# EAGLE design Mini-Voyger2_V13 (EAGLE 7.3.0)
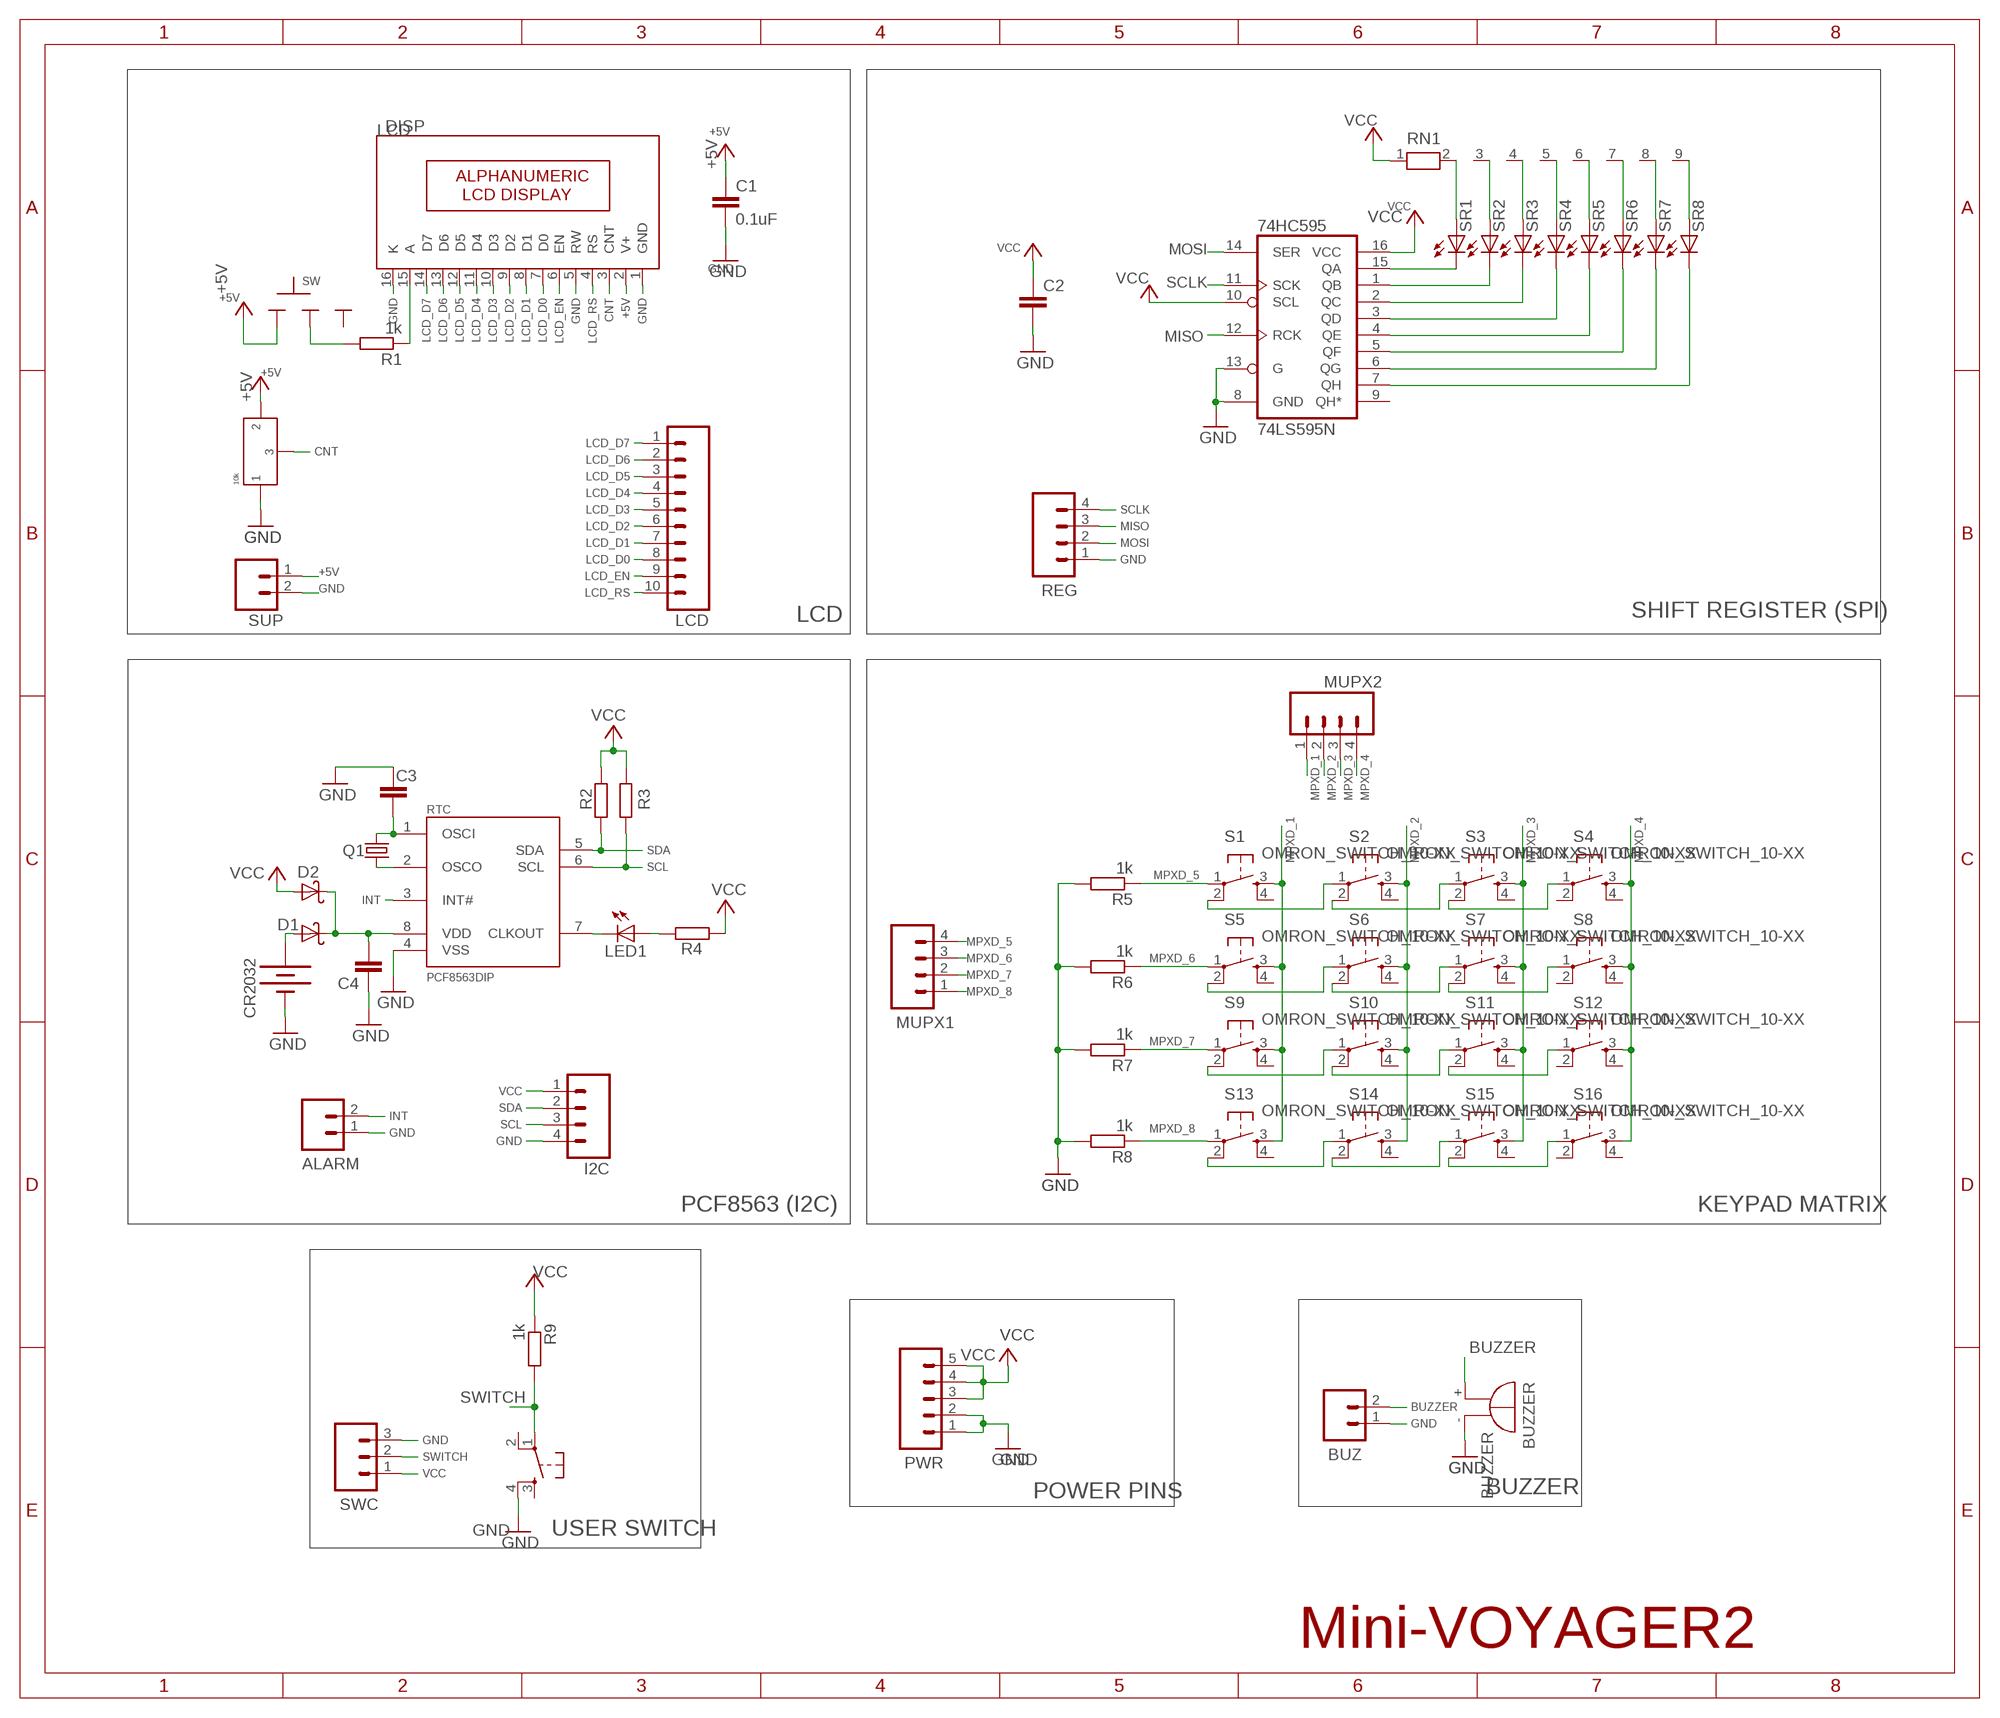
[diagram p0: schematic, sheet 1]

## Parts
74HC595  74LS595N  [DIL16]
ALARM  M02  [02P]
BUZ  M02  [02P]
BUZZER  BUZZER  [F/TMB]
C1  0.1uF  C-EU025-024X044  [C025-024X044]
C2  0.1uF  C-EU025-025X050  [C025-025X050]
C3  22pF  C-EU025-024X044  [C025-024X044]
C4  0.1uF  C-EU050-025X075  [C050-025X075]
CR2032  BATTERY20PTH  [BATTCOM_20MM_PTH]
D1  1N5819  [DO41-10]
D2  1N5819  [DO41-10]
DISP  LCD  16X2LCD  [16X2_LCD]
I2C  M04  [04P]
LCD  M10  [10P]
LED1  LED3MM  [LED3MM]
MUPX1  M04  [04P]
MUPX2  M04  [04P]
PRESET  10k  PRESET_LR  [PRESET_LR]
PWR  M05  [05P]
Q1  32678Hz  CRYSTALTC26H  [TC26H]
R1  1k  R-EU_0207/7  [0207/7]
R2  10k  R-EU_0207/7  [0207/7]
R3  10k  R-EU_0207/7  [0207/7]
R4  470  R-EU_0207/7  [0207/7]
R5  1k  R-EU_0207/7  [0207/7]
R6  1k  R-EU_0207/7  [0207/7]
R7  1k  R-EU_0207/7  [0207/7]
R8  1k  R-EU_0207/7  [0207/7]
R9  1k  R-EU_0207/7  [0207/7]
REG  M04  [04P]
RN1  1k  RN08  [RN-9]
RTC  PCF8563DIP  [DIL08]
S1  OMRON_SWITCH_10-XX  [B3F-10XX]
S2  OMRON_SWITCH_10-XX  [B3F-10XX]
S3  OMRON_SWITCH_10-XX  [B3F-10XX]
S4  OMRON_SWITCH_10-XX  [B3F-10XX]
S5  OMRON_SWITCH_10-XX  [B3F-10XX]
S6  OMRON_SWITCH_10-XX  [B3F-10XX]
S7  OMRON_SWITCH_10-XX  [B3F-10XX]
S8  OMRON_SWITCH_10-XX  [B3F-10XX]
S9  OMRON_SWITCH_10-XX  [B3F-10XX]
S10  OMRON_SWITCH_10-XX  [B3F-10XX]
S11  OMRON_SWITCH_10-XX  [B3F-10XX]
S12  OMRON_SWITCH_10-XX  [B3F-10XX]
S13  OMRON_SWITCH_10-XX  [B3F-10XX]
S14  OMRON_SWITCH_10-XX  [B3F-10XX]
S15  OMRON_SWITCH_10-XX  [B3F-10XX]
S16  OMRON_SWITCH_10-XX  [B3F-10XX]
SR1  LED3MM  [LED3MM]
SR2  LED3MM  [LED3MM]
SR3  LED3MM  [LED3MM]
SR4  LED3MM  [LED3MM]
SR5  LED3MM  [LED3MM]
SR6  LED3MM  [LED3MM]
SR7  LED3MM  [LED3MM]
SR8  LED3MM  [LED3MM]
SUP  M02  [02P]
SW  SLIDESWITCH-BIG  [BIGSWITCH]
SW1  OMRON_SWITCH_10-XX  [B3F-10XX]
SWC  M03  [03P]

## Nets
+5V: C1.1 DISP.2(V+) PRESET.P$2 SUP.1 SW.1
BUZZER: BUZ.2 BUZZER.+
CNT: DISP.3(CNT) PRESET.P$3
GND: 74HC595.8(GND) 74HC595.13(G) ALARM.1 BUZ.1 BUZZER.- C1.2 C2.2 C3.2 C4.1 CR2032.2(-) DISP.1(GND) DISP.5(RW) DISP.16(K) I2C.4 PRESET.P$1 PWR.1 PWR.2 R5.2 R6.2 R7.2 R8.2 REG.1 RTC.4(VSS) SUP.2 SW1.4(S1) SWC.3
INT: ALARM.2 RTC.3(INT#)
LCD_D0: DISP.7(D0) LCD.8
LCD_D1: DISP.8(D1) LCD.7
LCD_D2: DISP.9(D2) LCD.6
LCD_D3: DISP.10(D3) LCD.5
LCD_D4: DISP.11(D4) LCD.4
LCD_D5: DISP.12(D5) LCD.3
LCD_D6: DISP.13(D6) LCD.2
LCD_D7: DISP.14(D7) LCD.1
LCD_EN: DISP.6(EN) LCD.9
LCD_RS: DISP.4(RS) LCD.10
MISO: 74HC595.12(RCK) REG.3
MOSI: 74HC595.14(SER) REG.2
MPXD_1: MUPX2.1 S1.3(S) S5.3(S) S9.3(S) S13.3(S)
MPXD_2: MUPX2.2 S2.3(S) S6.3(S) S10.3(S) S14.3(S)
MPXD_3: MUPX2.3 S3.3(S) S7.3(S) S11.3(S) S15.3(S)
MPXD_4: MUPX2.4 S4.3(S) S8.3(S) S12.3(S) S16.3(S)
MPXD_5: MUPX1.4 R5.1 S1.1(P)
MPXD_6: MUPX1.3 R6.1 S5.1(P)
MPXD_7: MUPX1.2 R7.1 S9.1(P)
MPXD_8: MUPX1.1 R8.1 S13.1(P)
N$1 [power]: C4.2 D1.C D2.C RTC.8(VDD)
N$2: R1.2 SW.2
N$3: 74HC595.15(QA) SR1.K(C)
N$4: 74HC595.2(QC) SR3.K(C)
N$8: S1.2(P1) S2.1(P)
N$10: S2.2(P1) S3.1(P)
N$11: S3.2(P1) S4.1(P)
N$12: S5.2(P1) S6.1(P)
N$13: S6.2(P1) S7.1(P)
N$14: S7.2(P1) S8.1(P)
N$15: S9.2(P1) S10.1(P)
N$16: S10.2(P1) S11.1(P)
N$17: S11.2(P1) S12.1(P)
N$18: S13.2(P1) S14.1(P)
N$19: S14.2(P1) S15.1(P)
N$20: S15.2(P1) S16.1(P)
N$22: 74HC595.3(QD) SR4.K(C)
N$24: DISP.15(A) R1.1
N$29: 74HC595.4(QE) SR5.K(C)
N$39: 74HC595.5(QF) SR6.K(C)
N$40: 74HC595.6(QG) SR7.K(C)
N$41: 74HC595.7(QH) SR8.K(C)
N$42: 74HC595.1(QB) SR2.K(C)
N$43: RN1.2 SR1.A
N$44: RN1.3 SR2.A
N$45: RN1.4 SR3.A
N$46: RN1.5 SR4.A
N$47: RN1.6 SR5.A
N$48: RN1.7 SR6.A
N$49: RN1.8 SR7.A
N$50: RN1.9 SR8.A
N$56 [power]: CR2032.1(+) D1.A
N$57: Q1.1 RTC.2(OSCO)
N$58: C3.1 Q1.2 RTC.1(OSCI)
N$59: LED1.A R4.1
N$60: LED1.K(C) RTC.7(CLKOUT)
SCL: I2C.3 R3.2 RTC.6(SCL)
SCLK: 74HC595.11(SCK) REG.4
SDA: I2C.2 R2.2 RTC.5(SDA)
SWITCH: R9.2 SW1.1(P) SWC.2
VCC: 74HC595.10(SCL) 74HC595.16(VCC) C2.1 D2.A I2C.1 PWR.3 PWR.4 PWR.5 R2.1 R3.1 R4.2 R9.1 RN1.1 SWC.1 ; supply symbol labelled +5V, +3V3
Unconnected: 74HC595.9(QH*) S1.4(S1) S2.4(S1) S3.4(S1) S4.2(P1) S4.4(S1) S5.4(S1) S6.4(S1) S7.4(S1) S8.2(P1) S8.4(S1) S9.4(S1) S10.4(S1) S11.4(S1) S12.2(P1) S12.4(S1) S13.4(S1) S14.4(S1) S15.4(S1) S16.2(P1) S16.4(S1) SW1.2(P1) SW1.3(S) SW.3

## Notes on the sheet
- LCD | SHIFT REGISTER (SPI)
- PCF8563 (I2C)
- KEYPAD MATRIX
- POWER PINS | BUZZER
- USER SWITCH
- Mini-VOYAGER2

## Library data of the parts
74HC595 = SparkFun-DigitalIC:74*595: 8-bit SHIFT REGISTER, output latch
ALARM = con-amp-quick:M02: AMP QUICK CONNECTOR; OC_FARNELL: unknown; OC_NEWARK: unknown
BUZ SUP = CEDT_SEPTEMBER_V2:M02: AMP QUICK CONNECTOR
BUZZER = CEDT_JANUARY_2015_v5:BUZZER: BUZZER Source: Buerklin; OC_FARNELL: unknown; OC_NEWARK: unknown
C1-C4 = rcl:C-EU: CAPACITOR, European symbol
CR2032 = SparkFun-Electromechanical:BATTERY: Battery Holders Various common sizes : AA, AAA, 20mm coin cell and 12mm coin cell. 20MM_4LEGS, BATT-10373
D1 D2 = CEDT_JANUARY_2015:1N5819: DIODE general purpose rectifier, 1 A
DISP = CEDT_JANUARY_2015_v4:16X2LCD: ALPHANUMERIC-LCD
I2C = con-amp-quick:M04: AMP QUICK CONNECTOR; OC_FARNELL: unknown; OC_NEWARK: unknown
LCD = con-amp-quick:M10: AMP QUICK CONNECTOR; OC_FARNELL: unknown; OC_NEWARK: unknown
LED1 = CEDT_JANUARY_2015_v2:LED
MUPX1 MUPX2 REG = Bottom_Board:M04: AMP QUICK CONNECTOR; OC_FARNELL: unknown; OC_NEWARK: unknown
PRESET = CEDT_JANUARY_2015_v5:PRESET_LR
PWR = con-amp-quick:M05: AMP QUICK CONNECTOR; OC_FARNELL: unknown; OC_NEWARK: unknown
Q1 = CEDT_JANUARY_2015:CRYSTAL: Crystals Various standard crystals. Proven footprints. Spark Fun Electronics SKU : COM-00534
R1-R9 = rcl:R-EU_: RESISTOR, European symbol
RN1 = resistor-net:RN08: RESISTOR NETWORK; OC_FARNELL: unknown; OC_NEWARK: unknown
RTC = CEDT_JANUARY_2015:PCF8563
S1-S16 = CEDT_JANUARY_2015_v7:OMRON_SWITCH
SR1-SR8 = 01_adafruit:LED: LED OSRAM: - CHIPLED LG R971, LG N971, LY N971, LG Q971, LY Q971, LO R971, LY R971 LH N974, LH R974 LS Q976, LO Q976, LY Q976 LO Q996 - Hyper CHIPLED LW Q18S LB Q993, LB Q99A, LB R99A - SideLED LS A670, LO A670, LY A670, LG A670, LP A670 LB A673, LV A673, LT A673, LW A673 LH A674 LY A675 LS A676, LA A676, LO A676, LY A676, LW A676 LS A679, LY A679, LG A679 - Hyper Micro SIDELED® LS Y876, LA Y876, LO Y876, LY Y876 LT Y87S - SmartLED LW L88C, LW L88S LB L89C, LB L89S, LG L890 LS L89K, LO L89K, LY L89K LS L896, LA L896, LO L896, LY L896 - TOPLED LS T670, LO T670, LY T670, LG T670, LP T670 LSG T670, LSP T670, LSY T670, LOP T670, LYG T670 LG T671, LOG T671, LSG T671 LB T673, LV T673, LT T673, LW T673 LH T674 LS T676, LA T676, LO T676, LY T676, LB T676, LH T676, LSB T676, LW T676 LB T67C, LV T67C, LT T67C, LS T67K, LO T67K, LY T67K, LW E67C LS E67B, LA E67B, LO E67B, LY E67B, LB E67C, LV E67C, LT E67C LW T67C LS T679, LY T679, LG T679 LS T770, LO T770, LY T770, LG T770, LP T770 LB T773, LV T773, LT T773, LW T773 LH T774 LS E675, LA E675, LY E675, LS T675 LS T776, LA T776, LO T776, LY T776, LB T776 LHGB T686 LT T68C, LB T68C - Hyper Mini TOPLED® LB M676 - Mini TOPLED Santana® LG M470 LS M47K, LO M47K, LY M47K Source: http://www.osram.convergy.de/
SW = CEDT_JANUARY_2015_v5:SLIDESWITCH
SW1 = CEDT_JANUARY_2015_v5:OMRON_SWITCH
SWC = con-amp-quick:M03: AMP QUICK CONNECTOR; OC_FARNELL: unknown; OC_NEWARK: unknown

## Net classes
1 power: width 0.813 mm

## Board
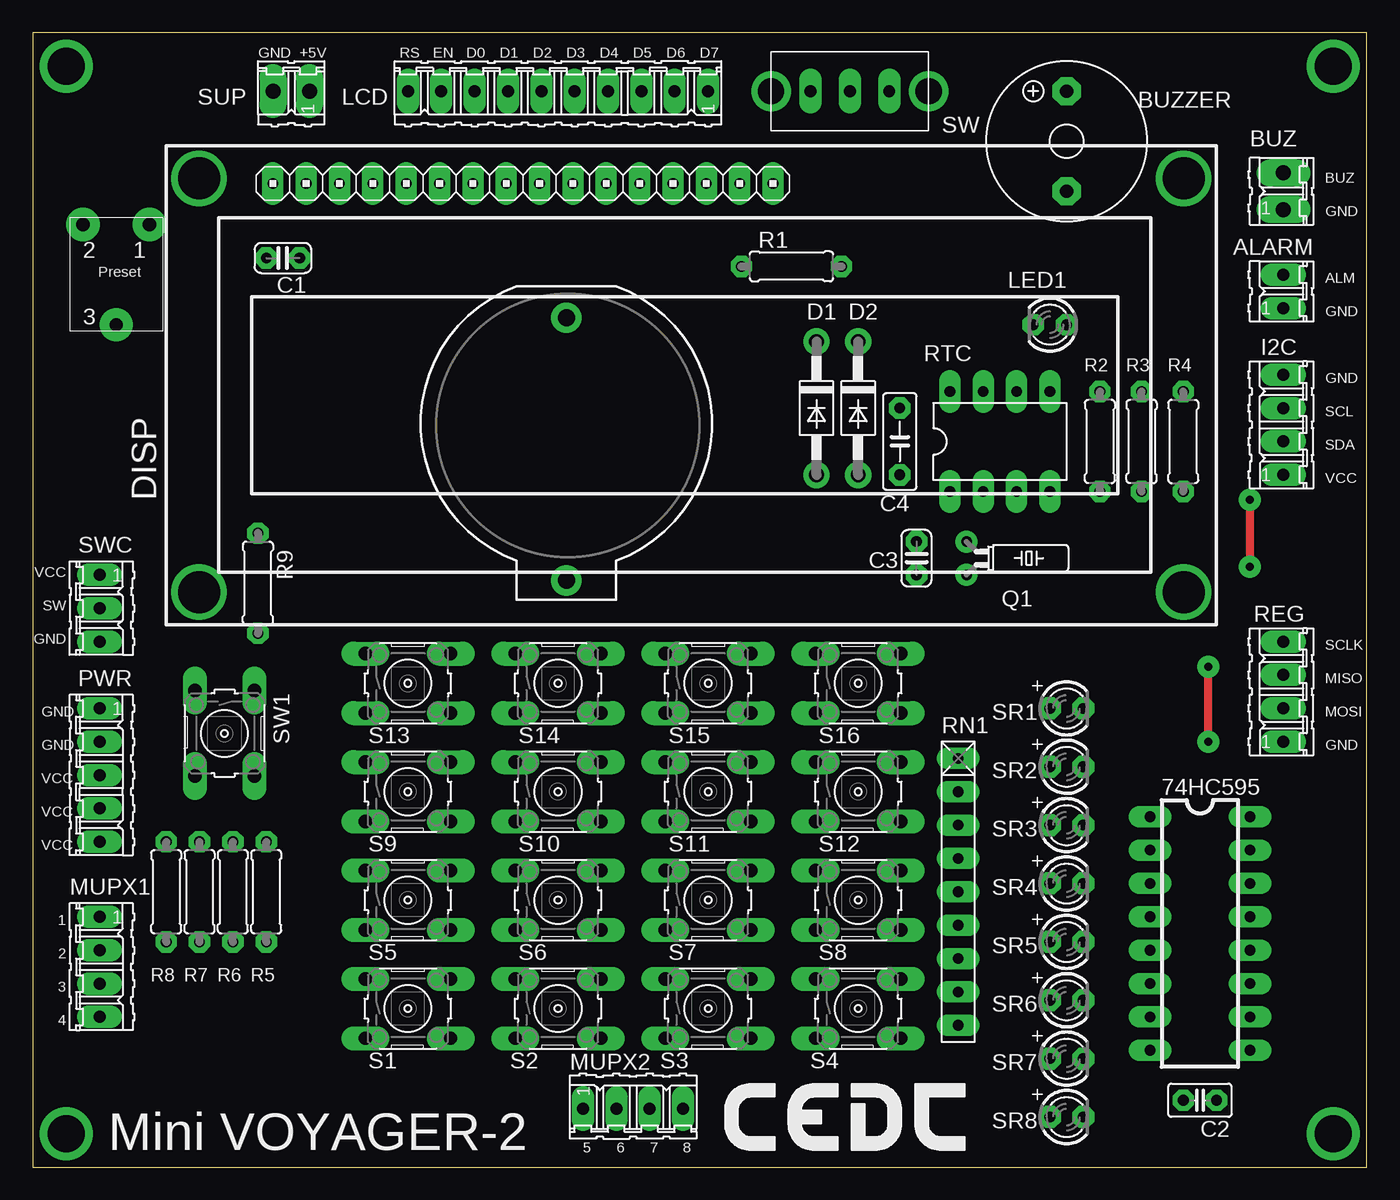
[diagram p1: board, top side]
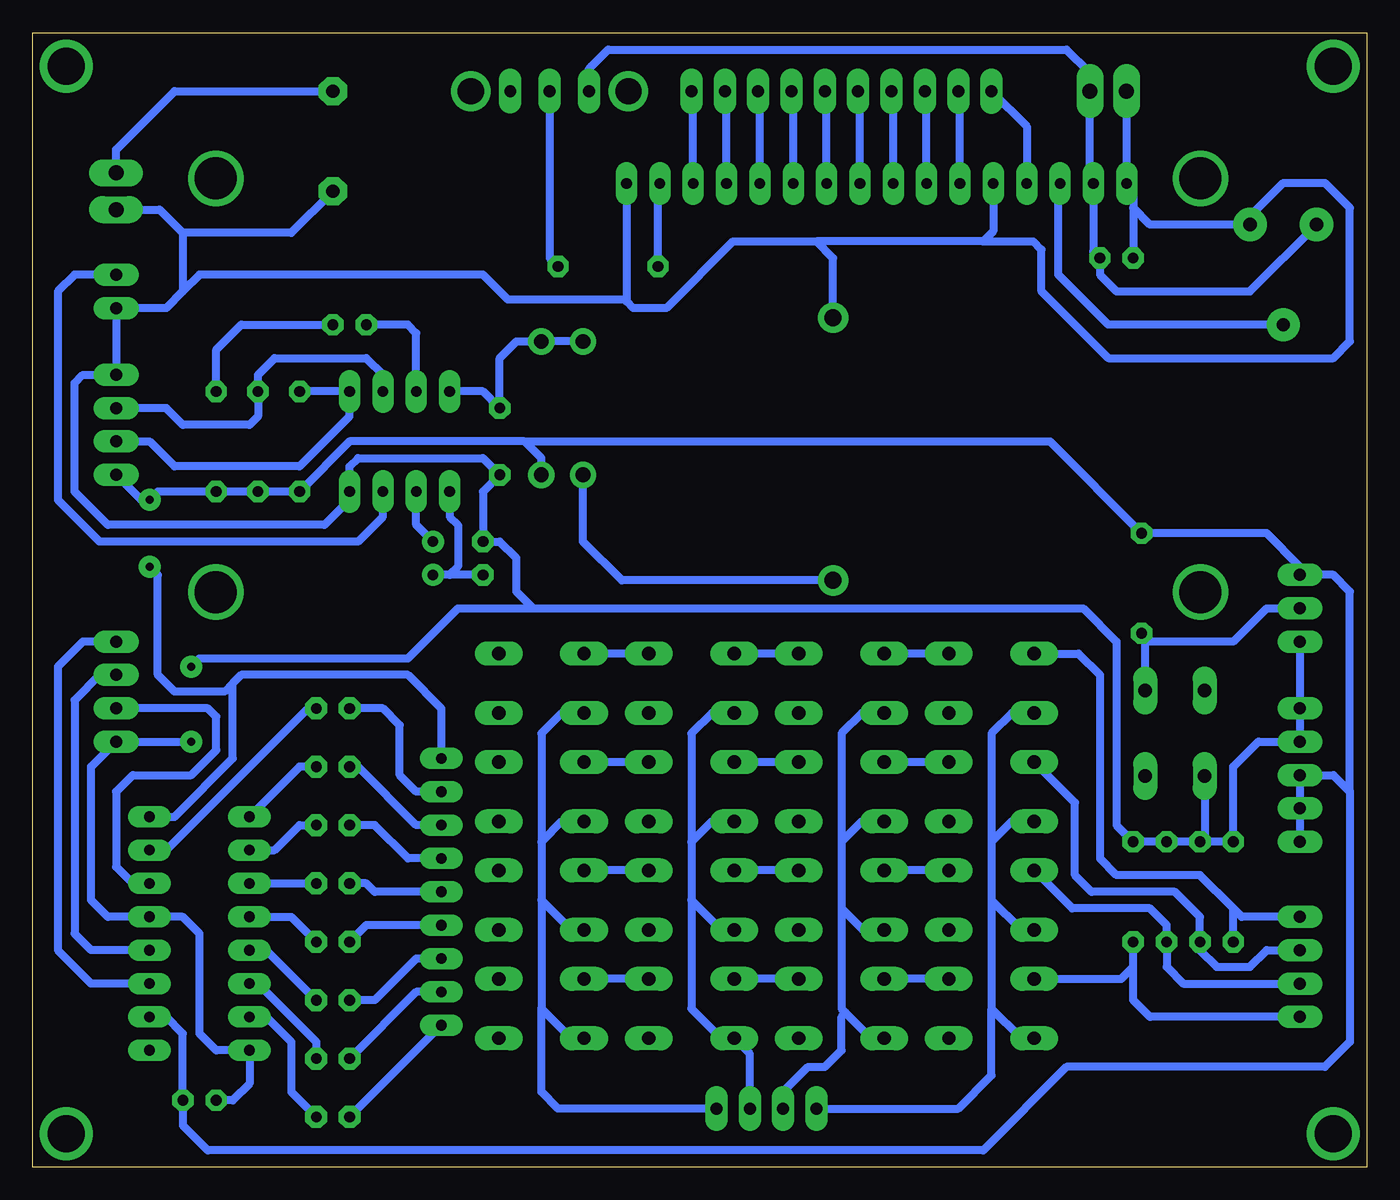
[diagram p2: board, bottom side, seen from below]

Size 101.6 x 86.36 mm. Coordinates in mm from the lower left corner, seen from the top.
Outline: 0,0 101.6,0 101.6,86.36 0,86.36 0,0
Copper layers (1*16): Top 0.035mm / dielectric 1.5mm / Bottom 0.035mm
Design rules "default *": minimum track width 16mil, minimum drill 24mil, track to track 16mil, track to pad 16mil, pad to pad 16mil, via to via 16mil, smd to smd 8mil, copper to edge 40mil, drill to drill 8mil, minimum pad ring 16mil, minimum via ring 8mil, stop-mask expansion 4mil, vias tented up to drill 0mil, thermal gap 10mil

### Footprints (pad centres in the part's own frame; a part is rotated, then mirrored left to right if it is on the bottom)
DIL16 = drill 0.813 long: 1 -8.89,-3.81; 2 -6.35,-3.81; 3 -3.81,-3.81; 4 -1.27,-3.81; 5 1.27,-3.81; 6 3.81,-3.81; 7 6.35,-3.81; 8 8.89,-3.81; 9 8.89,3.81; 10 6.35,3.81; 11 3.81,3.81; 12 1.27,3.81; 13 -1.27,3.81; 14 -3.81,3.81; 15 -6.35,3.81; 16 -8.89,3.81
02P = drill 0.914 long: 1 -1.27,0; 2 1.27,0
02P' = drill 1.143 long: 1 -1.397,0; 2 1.397,0
F/TMB = drill 1.016 pad 2.159 octagon: + 3.81,0; - -3.81,0
C025-024X044 = drill 0.813 octagon: 1 -1.27,0; 2 1.27,0
C025-025X050 = drill 0.813 octagon: 1 -1.27,0; 2 1.27,0
C050-025X075 = drill 0.813 octagon: 1 -2.54,0; 2 2.54,0
BATTCOM_20MM_PTH = drill 1.3: 1 11.85,0; 2 -8.15,0
DO41-10 = drill 1.118: A 5.08,0; C -5.08,0
16X2_LCD = drill 0.813 long: 1 8.12,33.608; 2 10.66,33.608; 3 13.2,33.608; 4 15.74,33.608; 5 18.28,33.608; 6 20.82,33.608; 7 23.36,33.608; 8 25.9,33.608; 9 28.44,33.608; 10 30.98,33.608; 11 33.52,33.608; 12 36.06,33.608; 13 38.6,33.608; 14 41.14,33.608; 15 43.68,33.608; 16 46.22,33.608 | drill 3.2: P$1 2.5,34; P$2 2.5,2.5; P$3 77.5,2.5; P$4 77.5,34
04P = drill 0.914 long: 1 -3.81,0; 2 -1.27,0; 3 1.27,0; 4 3.81,0
10P = drill 0.914 long: 1 -11.43,0; 2 -8.89,0; 3 -6.35,0; 4 -3.81,0; 5 -1.27,0; 6 1.27,0; 7 3.81,0; 8 6.35,0; 9 8.89,0; 10 11.43,0
LED3MM = drill 0.813 octagon: A -1.27,0; K 1.27,0
PRESET_LR = drill 1.016 pad 2.54: P$1 -2.54,-3.81; P$2 2.54,-3.81; P$3 0,3.81
05P = drill 0.914 long: 1 -5.08,0; 2 -2.54,0; 3 0,0; 4 2.54,0; 5 5.08,0
TC26H = drill 0.813 pad 1.676: 1 -1.27,0; 2 1.27,0
0207/7 = drill 0.813 octagon: 1 -3.81,0; 2 3.81,0
RN-9 = drill 0.813 long: 1 -10.16,0; 2 -7.62,0; 3 -5.08,0; 4 -2.54,0; 5 0,0; 6 2.54,0; 7 5.08,0; 8 7.62,0; 9 10.16,0
DIL08 = drill 0.813 long: 1 -3.81,-3.81; 2 -1.27,-3.81; 3 1.27,-3.81; 4 3.81,-3.81; 5 3.81,3.81; 6 1.27,3.81; 7 -1.27,3.81; 8 -3.81,3.81
B3F-10XX = drill 1.016 long: 1 -3.251,2.261; 2 3.251,2.261; 3 -3.251,-2.261; 4 3.251,-2.261
LED3MM' = drill 0.813 pad 1.676 octagon: A -1.27,0; K 1.27,0
BIGSWITCH = drill 0.9 long: 1 -3,0; 2 0,0; 3 3,0 | drill 2 pad 2.184: TAB1 -6,0; TAB2 6,0
03P = drill 0.914 long: 1 -2.54,0; 2 0,0; 3 2.54,0

### Placement (x,y rotation side)
74HC595  88.9,17.78 270 top
ALARM  95.25,66.67 90 top
BUZ  [02P']  95.25,74.3 90 top
BUZZER  78.74,78.11 90 top
C1  19.05,69.22 180 top
C2  88.9,5.08 180 top
C3  67.31,46.35 90 top
C4  66.04,55.24 90 top
CR2032  40.64,56.52 270 top
D1  59.69,57.78 270 top
D2  62.87,57.78 270 top
DISP  10.16,41.27 0 top
I2C  95.25,56.52 90 top
LCD  40.01,81.92 180 top
LED1  77.47,64.14 180 top
MUPX1  5.08,15.24 270 top
MUPX2  45.72,4.45 0 top
PRESET  6.35,67.94 180 top
PWR  5.08,29.84 270 top
Q1  71.12,46.35 270 top
R1  57.78,68.58 0 top
R2  81.28,55.24 90 top
R3  84.45,55.24 90 top
R4  87.63,55.24 270 top
R5  17.78,20.95 90 top
R6  15.24,20.95 90 top
R7  12.7,20.95 90 top
R8  10.16,20.95 90 top
R9  17.14,44.45 270 top
REG  95.25,36.2 90 top
RN1  70.48,20.95 270 top
RTC  73.66,55.24 0 top
S1  28.57,12.06 0 top
S2  40.01,12.06 0 top
S3  51.44,12.06 0 top
S4  62.87,12.06 0 top
S5  28.57,20.32 0 top
S6  40.01,20.32 0 top
S7  51.44,20.32 0 top
S8  62.87,20.32 0 top
S9  28.57,28.57 0 top
S10  40.01,28.57 0 top
S11  51.44,28.57 0 top
S12  62.87,28.57 0 top
S13  28.57,36.83 0 top
S14  40.01,36.83 0 top
S15  51.44,36.83 0 top
S16  62.87,36.83 0 top
SR1  [LED3MM']  78.74,34.92 0 top
SR2  [LED3MM']  78.74,30.48 0 top
SR3  [LED3MM']  78.74,26.04 0 top
SR4  [LED3MM']  78.74,21.59 0 top
SR5  [LED3MM']  78.74,17.14 0 top
SR6  [LED3MM']  78.74,12.7 0 top
SR7  [LED3MM']  78.74,8.26 0 top
SR8  [LED3MM']  78.74,3.81 0 top
SUP  [02P']  19.68,81.92 180 top
SW  62.23,81.92 0 top
SW1  14.61,33.02 270 top
SWC  5.08,42.55 270 top
U$2  [LOGO-CEDT-SILK-18MM]  52.7,1.27 0 top

### Tracks (layer width: path | path; a pad name or v marks a point on that pad's centre or on a via)
+5V
  Bottom 0.61: PRESET.P$2 8.89,66.67 19.05,66.67 20.32,67.94 C1.1 20.82,69.72 DISP.2 21.08,75.14 SUP.1 21.08,83.31 22.86,85.09 57.78,85.09 59.05,83.82 59.23,83.64 SW.1
BUZZER
  Bottom 0.61: BUZ.2 95.25,77.47 90.81,81.92 BUZZER.+
CNT
  Bottom 0.61: DISP.3 23.5,74.75 23.5,67.94 19.68,64.14 PRESET.P$3
GND  (via drill 0.6 pad 1.68)
  Top 0.61: v89.53,32.38 v89.53,38.1
  Bottom 0.61: 56.38,65.91 55.88,65.41 53.34,65.41 48.26,70.48 41.91,70.48 | DISP.1 17.78,74.38 17.78,73.03 | 17.78,73.03 C1.2 | 18.29,74.89 DISP.1 | DISP.16 56.38,65.91 | DISP.5 28.44,71.25 29.21,70.48 | DISP.1 18.28,81.91 SUP.2 | R7.2 R8.2 10.16,30.48 8.26,32.38 5.71,32.38 5.08,33.02 | R7.2 R6.2 R5.2 19.05,26.04 19.05,40.01 21.59,42.55 63.5,42.55 | SW1.4 12.34,25.12 R7.2 | CR2032.2 40.64,69.22 41.91,70.48 | 63.5,42.55 69.22,42.55 73.03,38.73 88.9,38.73 v89.53,38.1 | 17.78,73.03 16.51,71.75 PRESET.P$1 8.89,72.39 6.35,74.93 3.17,74.93 1.27,73.03 1.27,62.87 2.54,61.59 19.68,61.59 24.77,66.67 24.77,69.85 25.4,70.48 29.21,70.48 | 29.21,70.48 41.91,70.48 | 56.38,65.91 56.52,66.04 65.41,66.04 67.31,67.94 88.9,67.94 90.17,66.67 | v89.53,32.38 REG.1 97.16,30.48 97.16,20.32 95.89,19.05 74HC595.13 90.17,19.05 88.9,17.78 88.9,10.16 87.63,8.89 74HC595.8 85.09,6.35 86.36,5.08 C2.2 | 5.08,33.02 PWR.1 SWC.3 | 5.08,33.02 PWR.2 | BUZ.1 91.95,72.9 90.17,71.12 | 90.17,71.12 90.17,66.67 | 90.17,66.67 91.44,65.41 ALARM.1 I2C.4 97.79,60.33 98.42,59.69 98.42,51.44 95.89,48.9 79.38,48.9 77.47,50.8 RTC.4 77.47,53.34 76.83,53.98 67.31,53.98 C4.1 67.31,51.44 C3.2 66.04,47.62 64.77,46.35 64.77,43.81 63.5,42.55 | 90.17,71.12 81.92,71.12 BUZZER.-
INT
  Bottom 0.61: RTC.3 74.93,49.53 76.83,47.62 96.52,47.62 99.69,50.8 99.69,66.67 98.42,67.94 ALARM.2
LCD_D0
  Bottom 0.61: DISP.7 33.52,81.78 LCD.8
LCD_D1
  Bottom 0.61: DISP.8 36.06,81.78 LCD.7
LCD_D2
  Bottom 0.61: DISP.9 38.6,81.78 LCD.6
LCD_D3
  Bottom 0.61: DISP.10 41.14,81.78 LCD.5
LCD_D4
  Bottom 0.61: DISP.11 43.68,81.78 LCD.4
LCD_D5
  Bottom 0.61: DISP.12 46.22,81.78 LCD.3
LCD_D6
  Bottom 0.61: DISP.13 48.76,81.78 LCD.2
LCD_D7
  Bottom 0.61: DISP.14 51.3,81.78 LCD.1
LCD_EN
  Bottom 0.61: DISP.6 30.98,81.78 LCD.9
LCD_RS
  Bottom 0.61: LCD.10 25.9,79.24 DISP.4
MISO
  Bottom 0.61: REG.3 96.52,37.47 98.42,35.56 98.42,17.78 97.16,16.51 74HC595.12
MOSI
  Bottom 0.61: REG.2 88.27,34.92 87.63,34.29 87.63,31.75 89.53,29.84 93.98,29.84 95.25,28.57 95.25,22.86 93.98,21.59 74HC595.14
MPXD_1
  Bottom 0.61: S13.3 27.03,34.57 28.57,33.02 28.57,24.77 | 28.57,24.77 28.57,20.32 | 28.57,20.32 28.57,12.06 | S1.3 25.68,9.8 | 28.57,12.06 26.31,9.8 25.68,9.8 | S9.3 27.03,26.31 28.57,24.77 | S5.3 26.31,18.06 28.57,20.32 | 25.68,9.8 25.4,9.53 | MUPX2.1 31.11,4.45 28.57,6.99 28.57,12.06
MPXD_2
  Bottom 0.61: S14.3 38.46,34.57 40.01,33.02 40.01,24.77 | 40.01,24.77 40.01,19.68 | 40.01,19.68 40.01,12.06 39.69,11.75 | 39.69,11.75 37.74,9.8 S2.3 36.83,9.73 | S10.3 38.46,26.31 40.01,24.77 | S6.3 38.38,18.06 40.01,19.68 | MUPX2.2 44.45,5.71 42.55,7.62 41.27,7.62 40.01,8.89 40.01,11.43 39.69,11.75
MPXD_3
  Bottom 0.61: S15.3 49.89,34.57 51.44,33.02 51.44,24.77 | 51.44,24.77 51.44,20.32 | 51.44,20.32 51.44,12.06 49.17,9.8 S3.3 46.99,8.61 MUPX2.3 | S11.3 49.89,26.31 51.44,24.77 | S7.3 49.17,18.06 51.44,20.32
MPXD_4
  Bottom 0.61: S16.3 61.32,34.57 62.87,33.02 62.87,24.77 | 62.87,24.77 62.87,20.32 | 62.87,20.32 62.87,12.06 | 62.87,12.06 60.6,9.8 S4.3 59.69,9.73 | S12.3 61.32,26.31 62.87,24.77 | S8.3 60.6,18.06 62.87,20.32 | 62.87,12.06 62.87,5.71 61.59,4.45 MUPX2.4
MPXD_5
  Bottom 0.61: 17.78,15.24 R5.1 | S1.1 18.69,14.33 17.78,15.24 | MUPX1.4 16.51,11.43 17.78,12.7 17.78,15.24
MPXD_6
  Bottom 0.61: S5.1 22.43,19.68 16.51,19.68 15.24,18.41 R6.1 15.24,15.24 13.97,13.97 MUPX1.3
MPXD_7
  Bottom 0.61: S9.1 22.23,27.74 22.23,22.23 20.95,20.95 14.61,20.95 12.7,19.05 R7.1 12.7,16.51 11.43,15.24 8.89,15.24 7.62,16.51 MUPX1.2
MPXD_8
  Bottom 0.61: R8.1 10.16,19.68 | 10.16,19.68 12.7,22.23 19.05,22.23 20.32,23.5 20.32,37.47 21.95,39.09 S13.1 | MUPX1.1 9.53,19.05 10.16,19.68
N$1
  Bottom 0.61: RTC.8 67.31,59.05 C4.2 66.04,61.59 64.77,62.87 D2.C D1.C
N$2
  Bottom 0.61: SW.2 62.23,69.22 R1.2
N$3
  Bottom 0.61: 74HC595.15 91.44,24.13 80.64,34.92 SR1.K
N$4
  Bottom 0.61: 74HC595.2 83.19,24.13 81.28,26.04 SR3.K
N$5  (via drill 2.8 pad 4.01)
  other vias: 2.54,83.82
N$6  (via drill 2.8 pad 4.01)
  other vias: 99.06,83.82
N$7  (via drill 2.8 pad 4.01)
  other vias: 2.54,2.54
N$8
  Bottom 0.61: S1.2 S2.1
N$9  (via drill 2.8 pad 4.01)
  other vias: 99.06,2.54
N$10
  Bottom 0.61: S2.2 S3.1
N$11
  Bottom 0.61: S3.2 S4.1
N$12
  Bottom 0.61: S5.2 S6.1
N$13
  Bottom 0.61: S6.2 S7.1
N$14
  Bottom 0.61: S7.2 S8.1
N$15
  Bottom 0.61: S9.2 S10.1
N$16
  Bottom 0.61: S10.2 S11.1
N$17
  Bottom 0.61: S11.2 S12.1
N$18
  Bottom 0.61: S13.2 S14.1
N$19
  Bottom 0.61: S14.2 S15.1
N$20
  Bottom 0.61: S15.2 S16.1
N$22
  Bottom 0.61: 74HC595.3 SR4.K
N$24
  Bottom 0.61: R1.1 53.98,74.75 DISP.15
N$29
  Bottom 0.61: 74HC595.4 81.92,19.05 SR5.K
N$39
  Bottom 0.61: 74HC595.5 83.82,16.51 SR6.K
N$40
  Bottom 0.61: 74HC595.6 84.45,13.97 80.01,9.53 SR7.K
N$41
  Bottom 0.61: 74HC595.7 83.82,11.43 81.92,9.53 81.92,5.71 SR8.K
N$42
  Bottom 0.61: SR2.K 81.28,30.48 74HC595.1
N$43
  Bottom 0.61: RN1.2 72.39,28.57 73.66,29.84 73.66,33.66 74.93,34.92 SR1.A
N$44
  Bottom 0.61: RN1.3 72.39,26.04 76.83,30.48 SR2.A
N$45
  Bottom 0.61: RN1.4 73.03,23.5 75.56,26.04 SR3.A
N$46
  Bottom 0.61: RN1.5 75.56,20.95 76.2,21.59 SR4.A
N$47
  Bottom 0.61: RN1.6 76.2,18.41 SR5.A
N$48
  Bottom 0.61: RN1.7 72.39,15.88 75.56,12.7 SR6.A
N$49
  Bottom 0.61: RN1.8 72.39,13.34 SR7.A
N$50
  Bottom 0.61: RN1.9 SR8.A
N$56
  Bottom 0.61: CR2032.1 56.73,44.66 59.69,47.62 D1.A
N$57
  Bottom 0.61: Q1.1 72.39,48.9 RTC.2
N$58
  Bottom 0.61: C3.1 69.85,45.09 | 69.85,45.09 Q1.2 | RTC.1 69.85,49.53 69.22,48.9 69.22,45.72 69.85,45.09
N$59
  Bottom 0.61: R4.1 87.63,62.23 85.72,64.14 LED1.A
N$60
  Bottom 0.61: RTC.7 72.39,63.5 73.03,64.14 LED1.K
SCL
  Bottom 0.61: RTC.6 74.93,60.33 76.2,61.59 83.19,61.59 84.45,60.33 R3.2 84.45,57.15 85.09,56.52 90.17,56.52 91.44,57.78 I2C.3
SCLK
  Bottom 0.61: REG.4 97.79,40.01 99.69,38.1 99.69,16.51 97.16,13.97 74HC595.11
SDA
  Bottom 0.61: R2.2 RTC.5 77.47,57.15 81.28,53.34 90.81,53.34 92.71,55.24 I2C.2
SWITCH
  Bottom 0.61: SW1.1 16.87,40.36 R9.2 16.51,40.01 10.16,40.01 7.62,42.55 SWC.2
VCC  (via drill 0.6 pad 1.68)
  Top 0.61: v92.71,50.8 v92.71,45.72
  Bottom 0.61: 64.14,55.24 77.47,55.24 R2.1 R3.1 R4.2 92.08,51.44 v92.71,50.8 93.34,50.8 I2C.1 | D2.A 62.87,53.98 64.14,55.24 | RN1.1 70.48,34.92 73.03,37.47 85.72,37.47 86.36,36.83 | PWR.5 PWR.4 PWR.3 2.54,29.84 1.27,28.57 | 1.27,28.57 1.27,43.81 2.54,45.09 SWC.1 5.08,45.72 7.62,48.26 R9.1 24.13,55.24 64.14,55.24 | 1.27,28.57 1.27,9.53 3.17,7.62 22.86,7.62 29.21,1.27 88.27,1.27 90.17,3.17 C2.1 90.17,10.16 91.44,11.43 74HC595.10 | 74HC595.16 90.81,26.67 86.36,31.11 86.36,36.83 | 86.36,36.83 87,36.2 90.81,36.2 92.08,37.47 92.08,45.09 v92.71,45.72

### Text on the board
tPlace: GND | +5V | RS | EN | D0 | D1 | D2 | D3 | D4 | D5 | D6 | D7 | BUZ | GND | ALM | GND | GND | SCL | SDA | VCC | VCC | SW | GND | SCLK | MISO | GND | MOSI | GND | GND | VCC | VCC | VCC | 1 | 2 | 3 | 4 | 5 | 6 | 7 | 8 | Mini VOYAGER-2